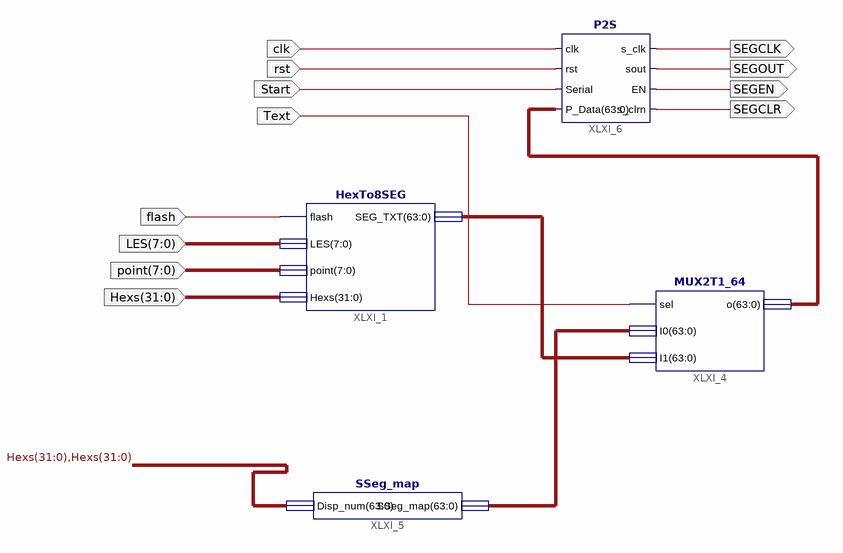
[diagram p0: schematic sheet 1]
// Xilinx ISE schematic Display.sch (kintex7) as structural Verilog: 4 symbols, 12 ports
module Display (
  input  flash,
  input  [7:0] LES,
  input  [7:0] point,
  input  [31:0] Hexs,
  input  clk,
  input  rst,
  input  Start,
  input  Text,
  output SEGCLK,
  output SEGOUT,
  output SEGEN,
  output SEGCLR
);

  wire [63:0] XLXN_17, XLXN_18, XLXN_19;

  HexTo8SEG XLXI_1 (.flash(flash), .LES(LES), .point(point), .Hexs(Hexs), .SEG_TXT(XLXN_19));
  MUX2T1_64 XLXI_4 (.sel(Text), .I0(XLXN_18), .I1(XLXN_19), .o(XLXN_17));
  SSeg_map XLXI_5 (.Disp_num({Hexs, Hexs}), .SSeg_map(XLXN_18));
  P2S XLXI_6 (
    .s_clrn(SEGCLR), .sout(SEGOUT), .rst(rst), .EN(SEGEN), .Serial(Start), .clk(clk), .s_clk(SEGCLK),
    .P_Data(XLXN_17));
endmodule
